# EAGLE design tracksoar chip breakout shield (EAGLE 7.3.0)
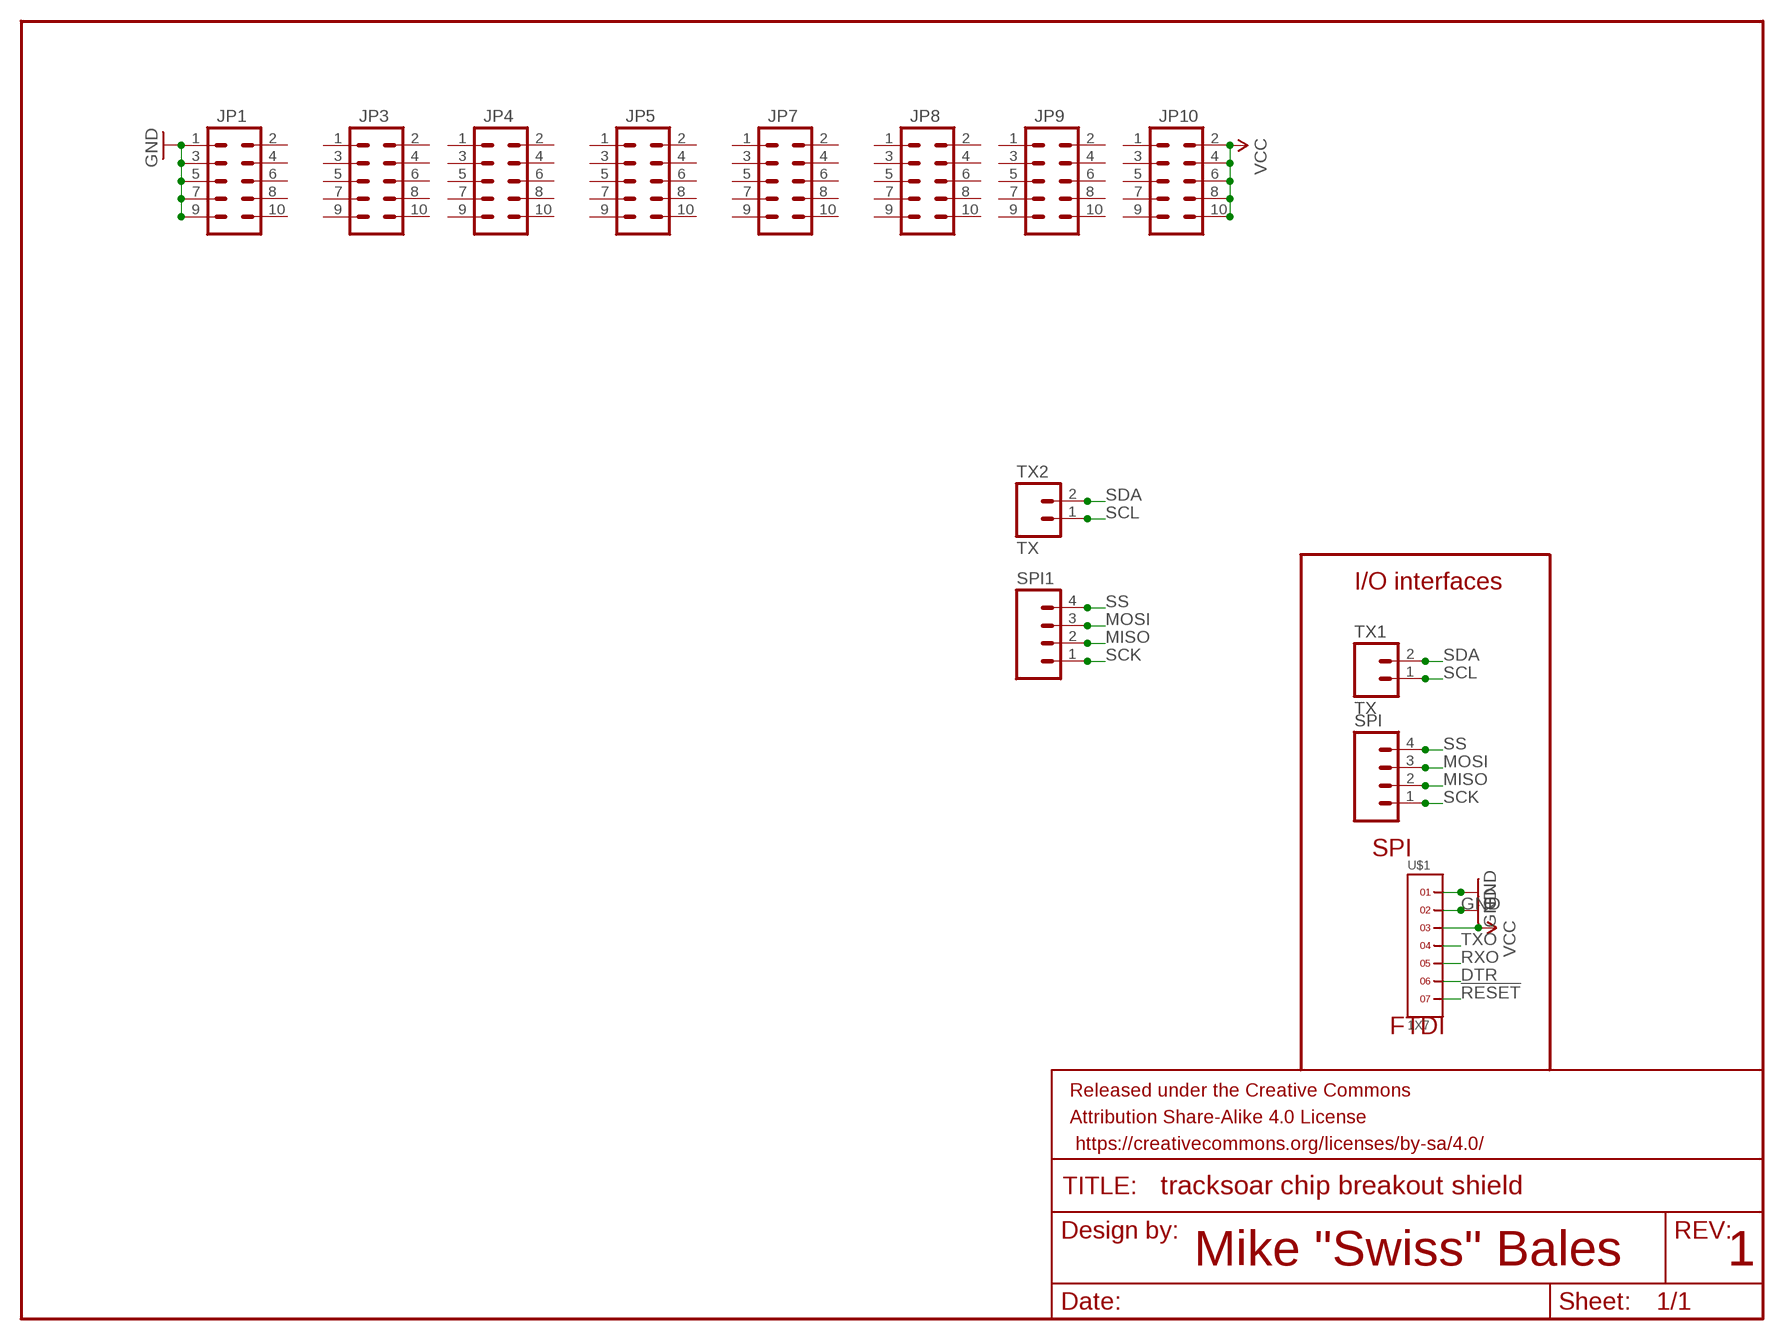
[diagram p0: schematic, sheet 1]

## Parts
FRAME1  FRAME-LETTER  [CREATIVE_COMMONS]
JP1  M05X2NO_SILK  [2X5_NOSILK]
JP3  M05X2NO_SILK  [2X5_NOSILK]
JP4  M05X2NO_SILK  [2X5_NOSILK]
JP5  M05X2NO_SILK  [2X5_NOSILK]
JP7  M05X2NO_SILK  [2X5_NOSILK]
JP8  M05X2NO_SILK  [2X5_NOSILK]
JP9  M05X2NO_SILK  [2X5_NOSILK]
JP10  M05X2NO_SILK  [2X5_NOSILK]
SPI  M04JST-PTH-VERT  [JST-4-PTH-VERT]
SPI1  M04JST-PTH-VERT  [JST-4-PTH-VERT]
TX1  TX  M02JST-PTH-VERT  [JST-2-PTH-VERT]
TX2  TX  M02JST-PTH-VERT  [JST-2-PTH-VERT]
U$1  1X7  [1X7]

## Nets
!RESET: U$1.7
DTR: U$1.6
GND: JP1.1 JP1.3 JP1.5 JP1.7 JP1.9 U$1.1 U$1.2
MISO: SPI1.2 SPI.2
MOSI: SPI1.3 SPI.3
RXO: U$1.5
SCK: SPI1.1 SPI.1
SCL: TX1.1 TX2.1
SDA: TX1.2 TX2.2
SS: SPI1.4 SPI.4
TXO: U$1.4
VCC: JP10.2 JP10.4 JP10.6 JP10.8 JP10.10 U$1.3
Unconnected: JP1.2 JP1.4 JP1.6 JP1.8 JP1.10 JP3.1 JP3.2 JP3.3 JP3.4 JP3.5 JP3.6 JP3.7 JP3.8 JP3.9 JP3.10 JP4.1 JP4.2 JP4.3 JP4.4 JP4.5 JP4.6 JP4.7 JP4.8 JP4.9 JP4.10 JP5.1 JP5.2 JP5.3 JP5.4 JP5.5 JP5.6 JP5.7 JP5.8 JP5.9 JP5.10 JP7.1 JP7.2 JP7.3 JP7.4 JP7.5 JP7.6 JP7.7 JP7.8 JP7.9 JP7.10 JP8.1 JP8.2 JP8.3 JP8.4 JP8.5 JP8.6 JP8.7 JP8.8 JP8.9 JP8.10 JP9.1 JP9.2 JP9.3 JP9.4 JP9.5 JP9.6 JP9.7 JP9.8 JP9.9 JP9.10 JP10.1 JP10.3 JP10.5 JP10.7 JP10.9

## Notes on the sheet
- I/O interfaces
- SPI
- FTDI
- Mike "Swiss" Bales | 1

## Library data of the parts
FRAME1 = SparkFun-Aesthetics:FRAME-LETTER: Schematic Frame Standard 8.5x11 US Letter frame
JP1 JP3-JP5 JP7-JP10 = SparkFun-Connectors:M05X2: Header 5x2 Standard 10-pin dual row 0.1" header. Commonly used with AVR-ISP. Use with Spark Fun Electronics SKU: PRT-00778
SPI SPI1 = SparkFun-Connectors:M04: Header 4 Standard 4-pin 0.1" header. Use with straight break away headers (SKU : PRT-00116), right angle break away headers (PRT-00553), swiss pins (PRT-00743), machine pins (PRT-00117), and female headers (PRT-00115). Molex polarized connector foot print use with SKU : PRT-08231 with associated crimp pins and housings. 1MM SMD Version SKU: PRT-10208
TX1 TX2 = SparkFun-Connectors:M02: Standard 2-pin 0.1" header. Use with - straight break away headers ( PRT-00116) - right angle break away headers (PRT-00553) - swiss pins (PRT-00743) - machine pins (PRT-00117) - female headers (PRT-00115) Molex polarized connector foot print use with: PRT-08233 with associated crimp pins and housings. 2.54_SCREWTERM for use with PRT-10571. 3.5mm Screw Terminal footprints for PRT-08084 5mm Screw Terminal footprints for use with PRT-08432
U$1 = headers(2mm):1X7

## Board
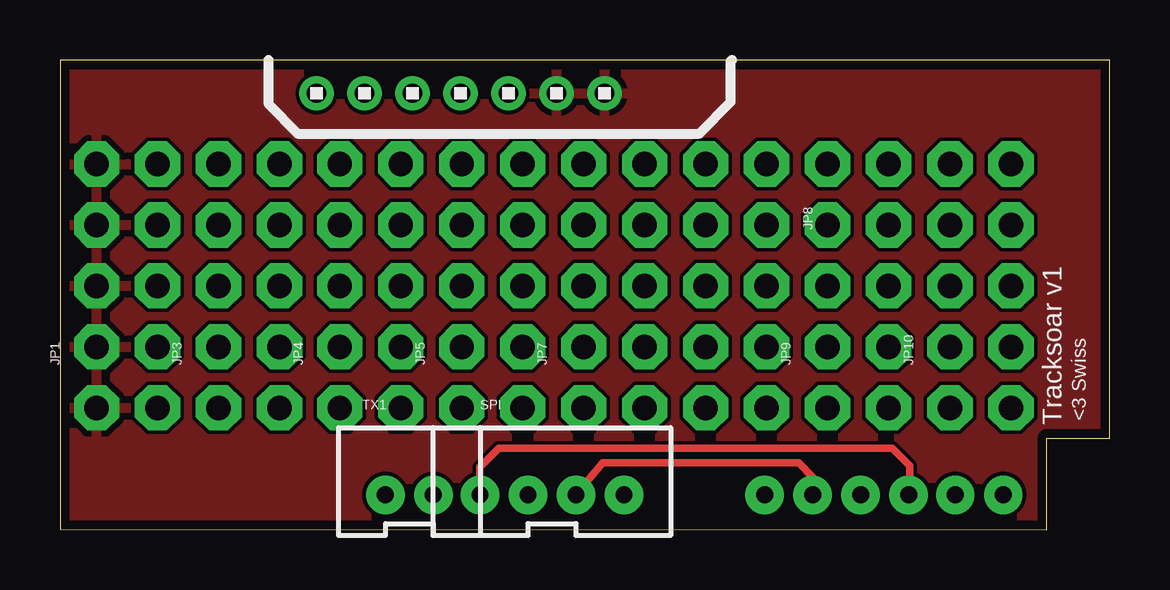
[diagram p1: board, top side]
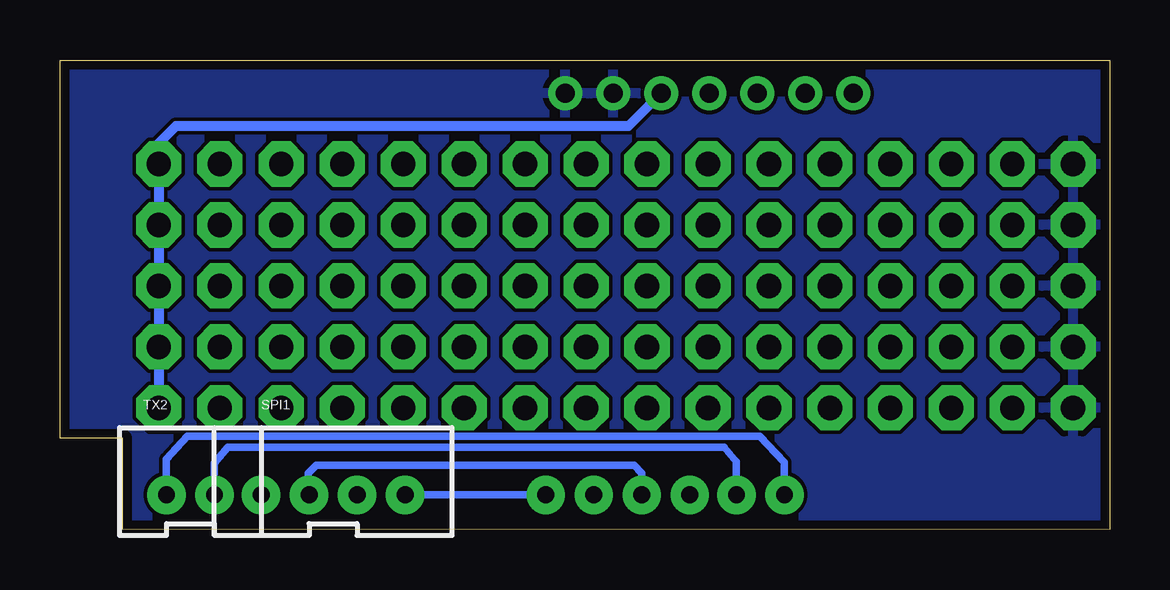
[diagram p2: board, bottom side, seen from below]

Size 43.74 x 19.57 mm. Coordinates in mm from the lower left corner, seen from the top.
Outline: 41.12,0 0,0.03 0,19.57 43.74,19.57 43.74,3.81 41.12,3.81 41.12,0.03
Copper layers (1*16): Top 0.0356mm / dielectric 1.5011mm / Bottom 0.0356mm
Design rules "oshpark-2layer": minimum track width 6mil, minimum drill 13mil, track to track 6mil, track to pad 6mil, pad to pad 6mil, via to via 6mil, smd to smd 6mil, copper to edge 15mil, drill to drill 6mil, minimum pad ring 7mil, minimum via ring 7mil, stop-mask expansion 4mil, vias tented up to drill 0mil, thermal gap 10mil

### Footprints (pad centres in the part's own frame; a part is rotated, then mirrored left to right if it is on the bottom)
2X5_NOSILK = drill 1.016 pad 1.88 octagon: 1 -1.27,5.08; 2 1.27,5.08; 3 -1.27,2.54; 4 1.27,2.54; 5 -1.27,0; 6 1.27,0; 7 -1.27,-2.54; 8 1.27,-2.54; 9 -1.27,-5.08; 10 1.27,-5.08
JST-4-PTH-VERT = drill 0.7 pad 1.6: 1 -3,-0.55; 2 -1,-0.55; 3 1,-0.55; 4 3,-0.55
JST-2-PTH-VERT = drill 0.7 pad 1.6: 1 -1,-0.55; 2 1,-0.55
1X7 = drill 0.8 pad 1.422: 1 -6,0; 2 -4,0; 3 -2,0; 4 0,0; 5 2,0; 6 4,0; 7 6,0

### Placement (x,y rotation side)
FRAME1  14.78,-7.8 0 top  (outside the outline)
JP1  2.79,10.16 0 top
JP3  7.87,10.16 0 top
JP4  12.93,10.16 0 top
JP5  18.01,10.16 0 top
JP7  23.09,10.16 0 top
JP8  28.17,10.16 180 top
JP9  33.25,10.16 0 top
JP10  38.35,10.16 0 top
SPI  20.5,2.01 0 top
SPI1  32.36,2.01 0 bottom
TX1  14.55,2.01 0 top
TX2  38.3,2.01 0 bottom
U$1  16.69,18.19 180 top

### Tracks (layer width: path | path; a pad name or v marks a point on that pad's centre or on a via)
GND
  pour Top: 0,19.58 43.74,19.58 43.74,0 0,0.03 0.05,3.78
  pour Bottom: 0,19.58 43.74,19.58 43.74,0 0,0.03 0.05,3.78
MISO
  Bottom 0.305: SPI.2 19.5,2.35 19.81,2.69 33.07,2.69 33.4,2.36 33.4,1.5 SPI1.2
MOSI
  Top 0.305: SPI1.3 31.36,2.19 30.78,2.79 22.61,2.79 SPI.3
SCK
  Top 0.305: SPI.1 17.5,2.61 18.29,3.4 34.67,3.4 35.41,2.67 35.41,1.5 SPI1.1
SCL
  Bottom 0.305: TX1.1 13.55,2.81 14.58,3.89 38.43,3.89 39.32,2.95 39.32,1.47 TX2.1
SDA
  Bottom 0.305: TX1.2 15.55,2.83 16.05,3.43 36.75,3.43 37.31,2.77 TX2.2
SS
  Bottom 0.305: SPI.4 SPI1.4
VCC
  Bottom 0.406: JP10.10 JP10.8 JP10.6 JP10.4 JP10.2 39.67,15.37 39.67,16.05 38.91,16.81 20.06,16.81 U$1.3

### Text on the board
tNames: Tracksoar v1 | <3 Swiss